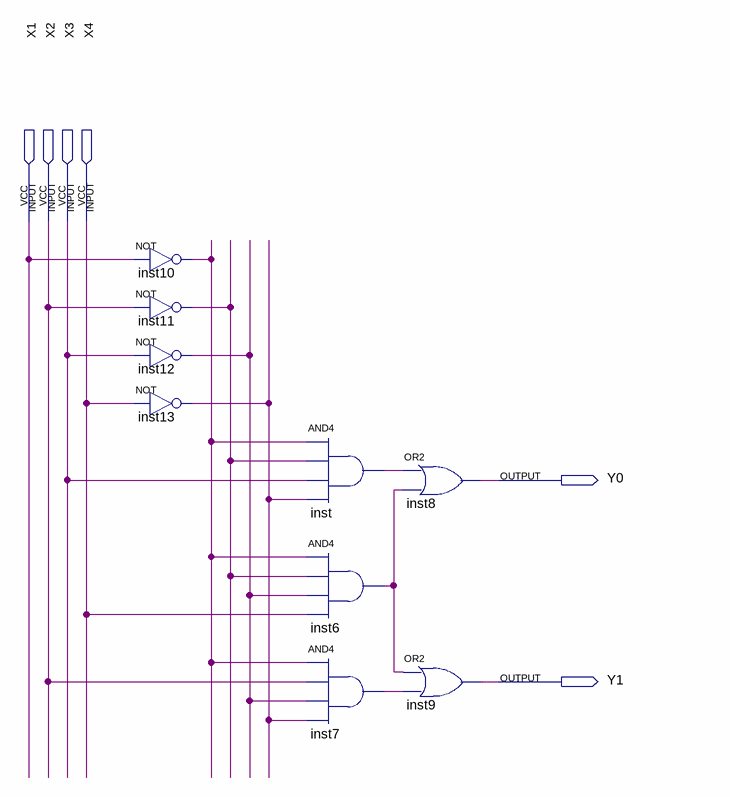
[diagram p0: schematic sheet]
// Quartus schematic 3laba(2shem).bdf as structural Verilog: 9 symbols, 6 pins
module \3laba(2shem)  (
  input  X1,
  input  X2,
  input  X3,
  input  X4,
  output Y0,
  output Y1
);

  wire inst6_out, inst7_out, inst10_out, inst11_out, inst12_out, inst13_out, inst_out;

  not inst10 (inst10_out, X1);
  not inst11 (inst11_out, X2);
  not inst12 (inst12_out, X3);
  not inst13 (inst13_out, X4);
  and inst (inst_out, inst10_out, inst11_out, X3, inst13_out);
  and inst6 (inst6_out, inst10_out, inst11_out, inst12_out, X4);
  and inst7 (inst7_out, inst10_out, X2, inst12_out, inst13_out);
  or inst8 (Y0, inst_out, inst6_out);
  or inst9 (Y1, inst6_out, inst7_out);
endmodule
